# Altium project DC_Main_sample_A.PrjPcb (part 2 of 2)

## Sheet STM32.SchDoc
size D; SheetNumber: 8; SheetTotal: 8
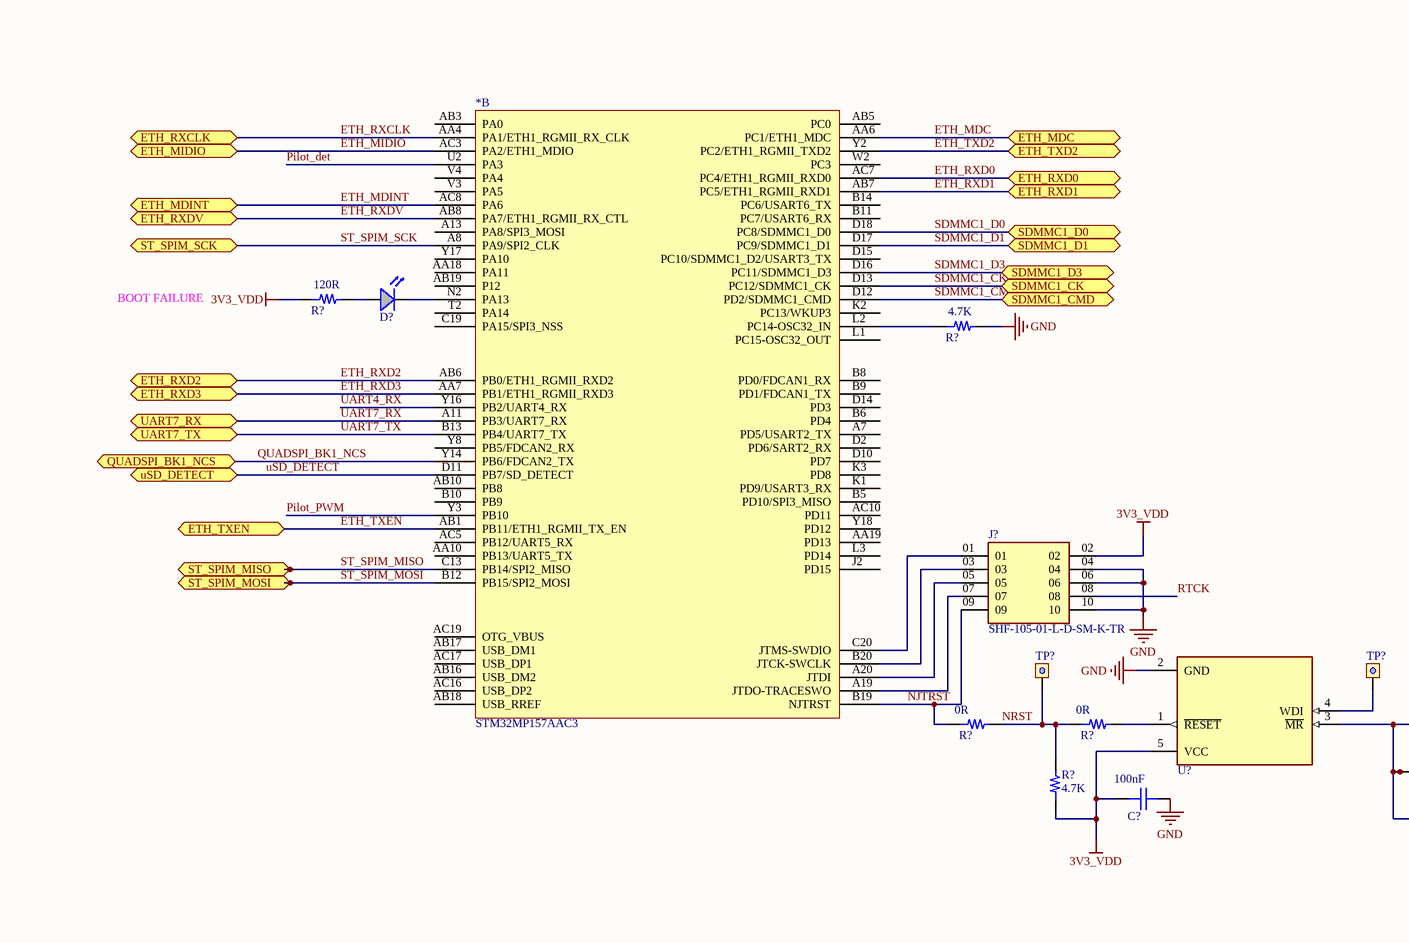
[diagram p6: STM32.SchDoc, top left]
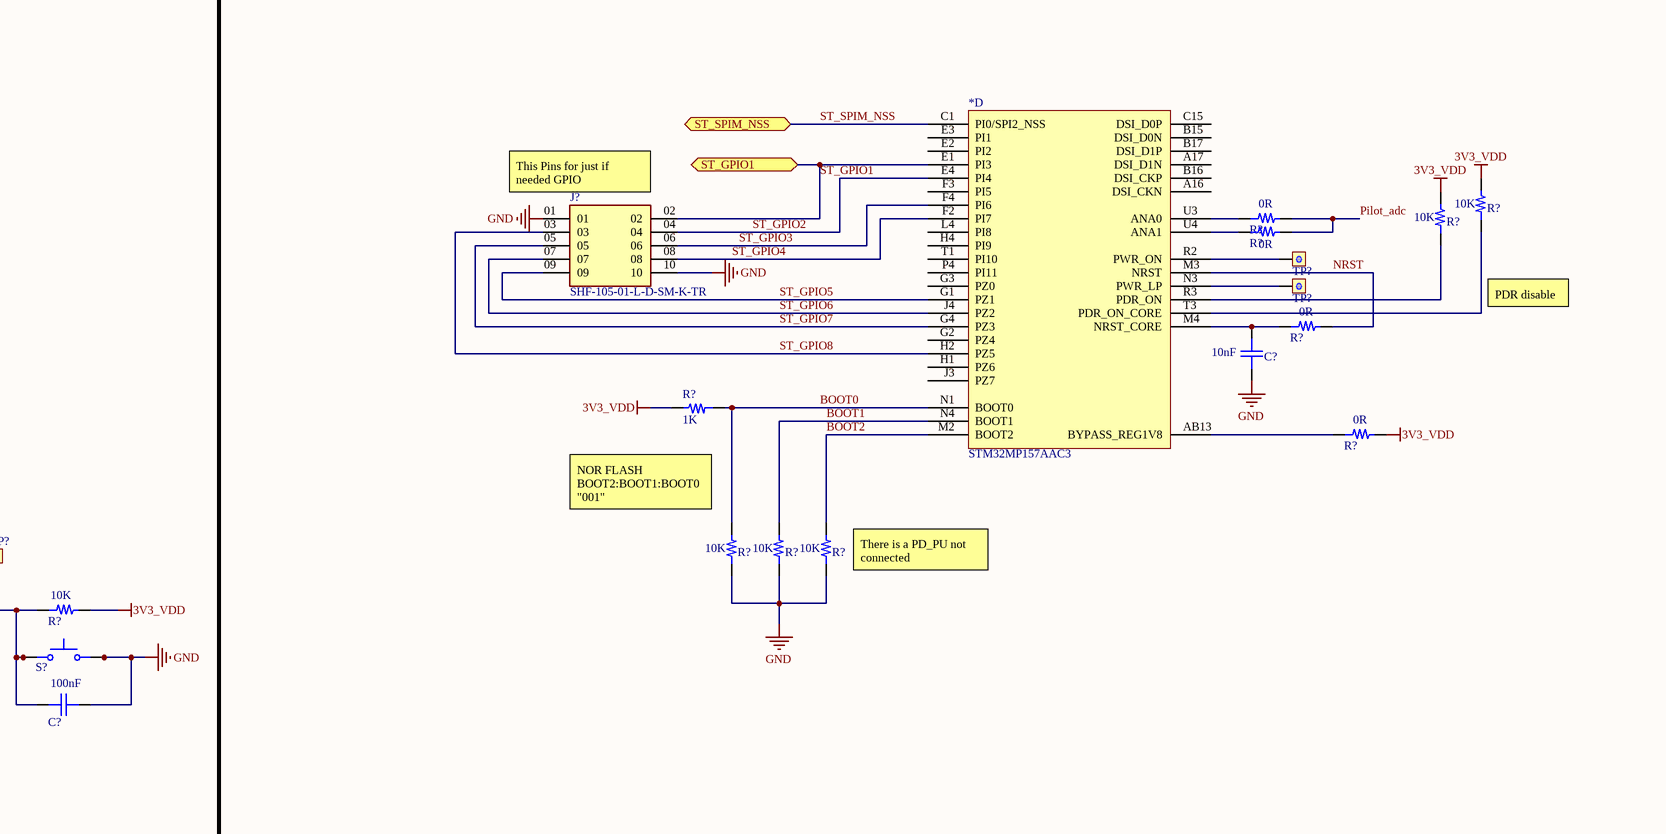
[diagram p7: STM32.SchDoc, top middle]
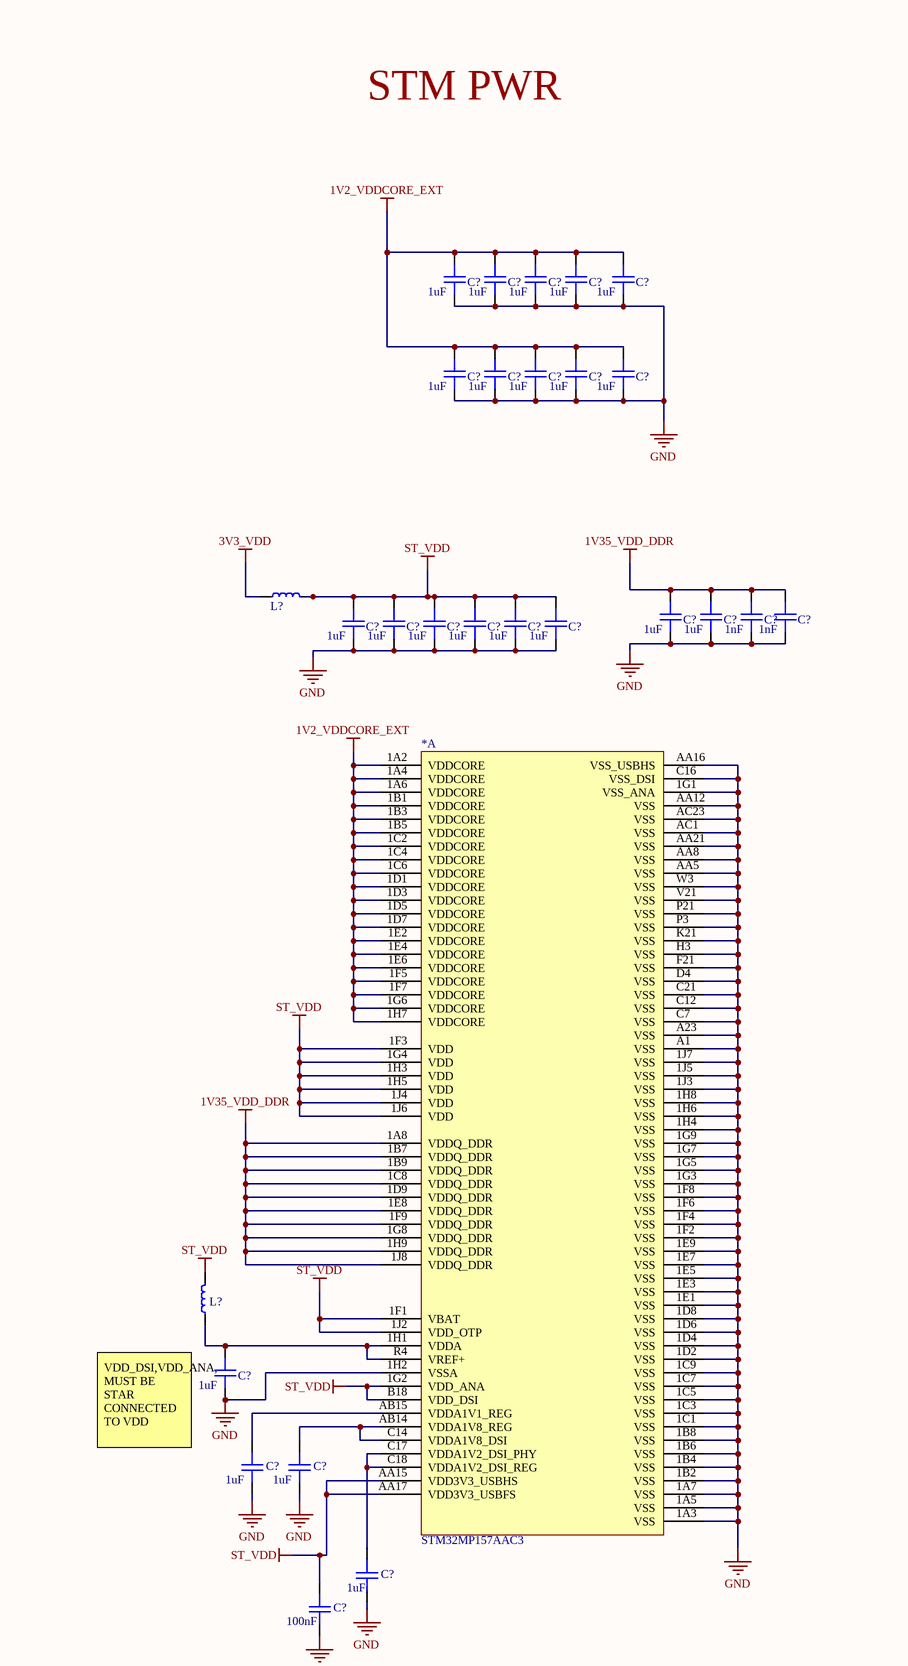
[diagram p8: STM32.SchDoc, top right]
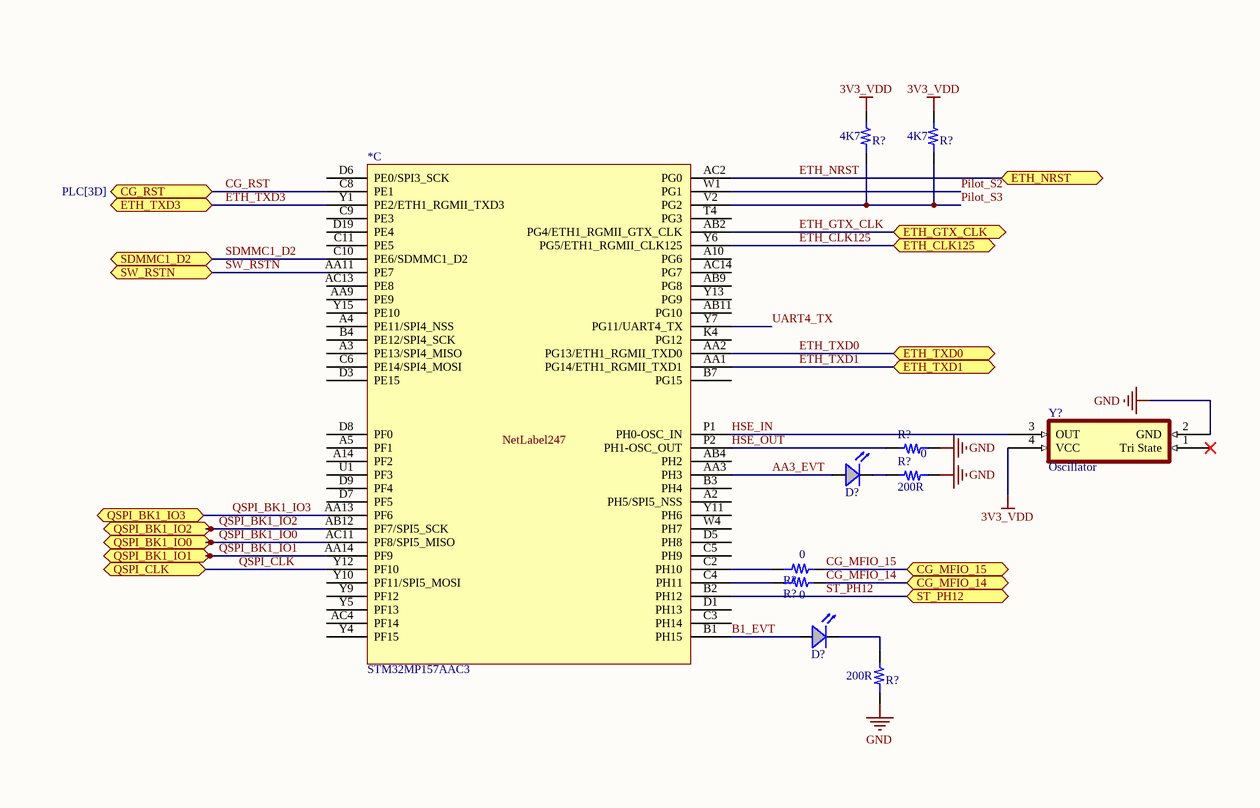
[diagram p9: STM32.SchDoc, bottom left]
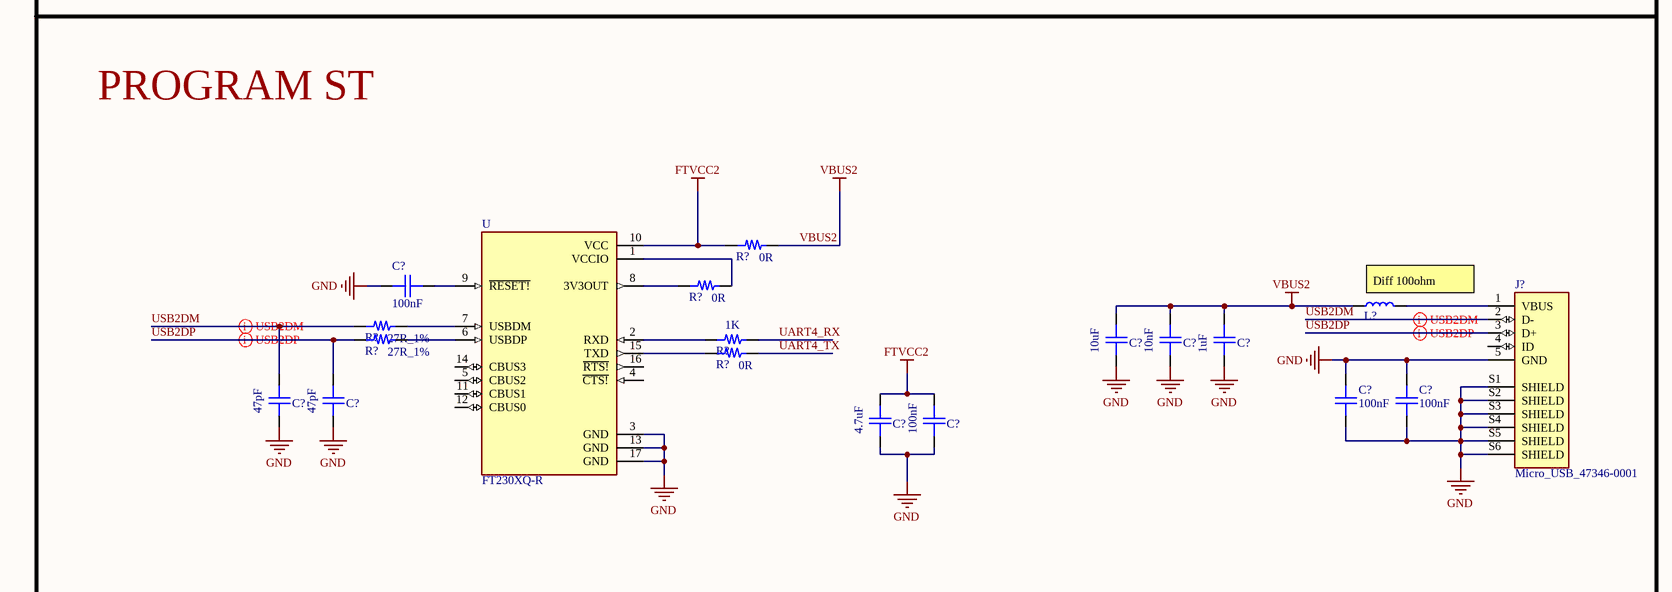
[diagram p10: STM32.SchDoc, bottom middle]
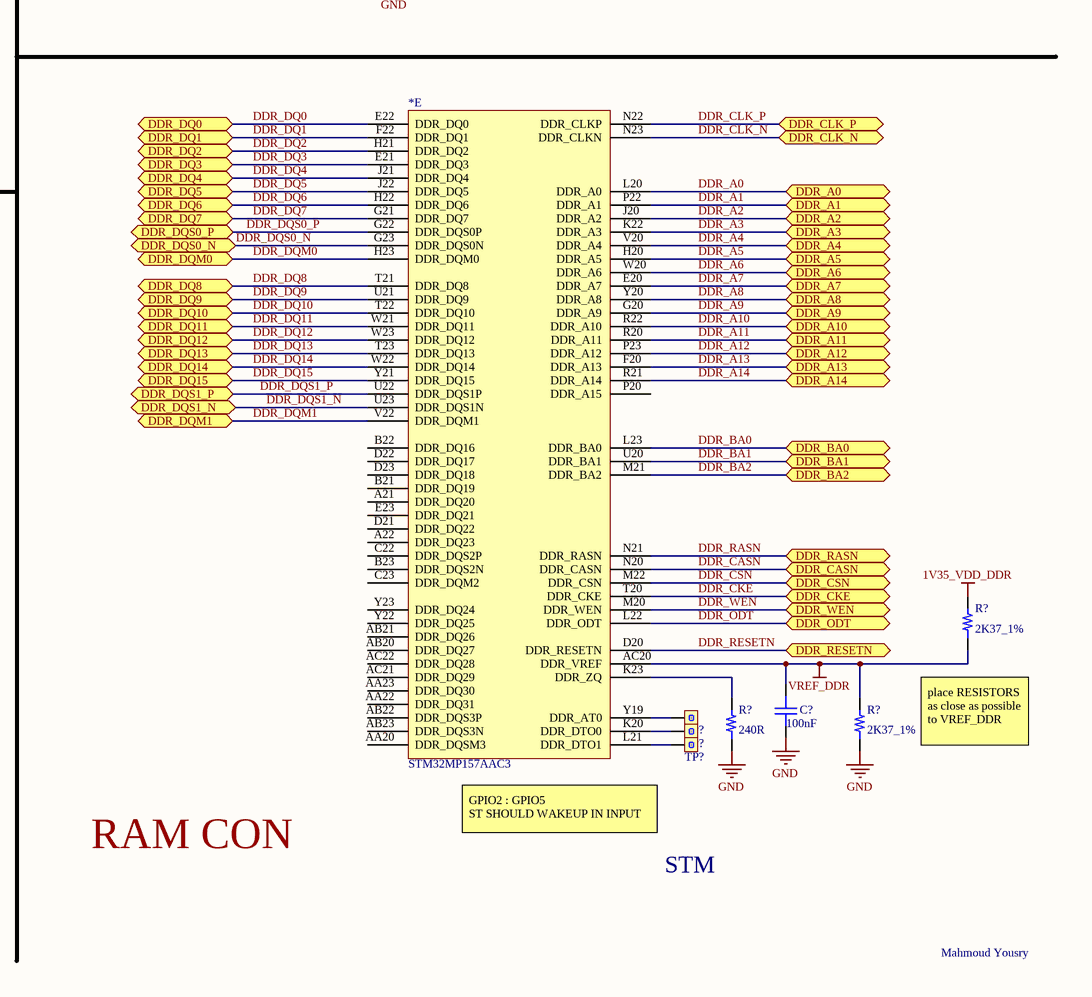
[diagram p11: STM32.SchDoc, bottom right]

### Parts
(Parts that share a designator on the sheet are numbered #1, #2 ... from top to bottom, then left to right.)
*#1  STM32MP157AAC3  (part B of 5)
*#2  STM32MP157AAC3  (part D of 5)
*#3  STM32MP157AAC3  (part A of 5)
*#4  STM32MP157AAC3  (part C of 5)
*#5  STM32MP157AAC3  (part E of 5)
C?#125  value 1uF  [C0402]  (hidden comment: Capacitor)
C?#126  value 1uF  [C0402]  (hidden comment: Capacitor)
C?#127  value 1uF  [C0402]  (hidden comment: Capacitor)
C?#128  value 1uF  [C0402]  (hidden comment: Capacitor)
C?#129  value 1uF  [C0402]  (hidden comment: Capacitor)
C?#130  value 1uF  [C0402]  (hidden comment: Capacitor)
C?#131  value 1uF  [C0402]  (hidden comment: Capacitor)
C?#132  value 1uF  [C0402]  (hidden comment: Capacitor)
C?#133  value 1uF  [C0402]  (hidden comment: Capacitor)
C?#134  value 1uF  [C0402]  (hidden comment: Capacitor)
C?#135  value 1uF  [C0402]  (hidden comment: Capacitor)
C?#136  value 1uF  [C0402]  (hidden comment: Capacitor)
C?#137  value 1nF  [C0402]  (hidden comment: Capacitor)
C?#138  value 1nF  [C0402]  (hidden comment: Capacitor)
C?#139  value 1uF  [C0402]  (hidden comment: Capacitor)
C?#140  value 1uF  [C0402]  (hidden comment: Capacitor)
C?#141  value 1uF  [C0402]  (hidden comment: Capacitor)
C?#142  value 1uF  [C0402]  (hidden comment: Capacitor)
C?#143  value 1uF  [C0402]  (hidden comment: Capacitor)
C?#144  value 1uF  [C0402]  (hidden comment: Capacitor)
C?#145  value 10nF  [C0402]  (hidden comment: Capacitor)
C?#146  value 100nF  [C0402]  (hidden comment: Capacitor)
C?#147  value 100nF  [C0402]  (hidden comment: Capacitor)
C?#148  value 1uF  [C0402]  (hidden comment: Capacitor)
C?#149  value 1uF  [C0402]  (hidden comment: Capacitor)
C?#150  value 1uF  [C0402]  (hidden comment: Capacitor)
C?#151  value 1uF  [C0402]  (hidden comment: Capacitor)
C?#152  value 100nF  [C0402]  (hidden comment: Capacitor)
C?#153  value 100nF  [C0402]  (hidden comment: Capacitor)
C?#154  value 10uF  [C0402]  (hidden comment: Capacitor)
C?#155  value 10nF  [C0402]  (hidden comment: Capacitor)
C?#156  value 1uF  [C0402]  (hidden comment: Capacitor)
C?#157  value 47pF  [C0402]  (hidden comment: Capacitor)
C?#158  value 47pF  [C0402]  (hidden comment: Capacitor)
C?#159  value 100nF  [C0402]  (hidden comment: Capacitor)
C?#160  value 100nF  [C0402]  (hidden comment: Capacitor)
C?#161  value 4.7uF  [C0402]  (hidden comment: Capacitor)
C?#162  value 100nF  [C0402]  (hidden comment: Capacitor)
C?#163  value 100nF  [C0402]  (hidden comment: Capacitor)
D?#7  LED  [LED_0603]  (value not drawn)
D?#8  LED  [LED_0603]  (value not drawn)
D?#9  LED  [LED_0603]  (value not drawn)
J?#5  SHF-105-01-L-D-SM-K-TR  [SAMTEC_SHF-105-01-L-D-SM-K-TR]
J?#6  SHF-105-01-L-D-SM-K-TR  [SAMTEC_SHF-105-01-L-D-SM-K-TR]
J?#7  Micro_USB_47346-0001  [Micro_USB_47346-0001]
L?#16  Inductor  [L_0603]  (value not drawn)
L?#17  Inductor  [L_0603]  (value not drawn)
L?#18  Inductor  [L_0603]  (value not drawn)
R?#84  value 120R  [R0402]  (hidden comment: Resistor)
R?#85  value 4.7K  [R0402]  (hidden comment: Resistor)
R?#86  value 0R  [R0402]  (hidden comment: Resistor)
R?#87  value 0R  [R0402]  (hidden comment: Resistor)
R?#88  value 10K  [R0402]  (hidden comment: Resistor)
R?#89  value 10K  [R0402]  (hidden comment: Resistor)
R?#90  value 0R  [R0402]  (hidden comment: Resistor)
R?#91  value 1K  [R0402]  (hidden comment: Resistor)
R?#92  value 0R  [R0402]  (hidden comment: Resistor)
R?#93  value 10K  [R0402]  (hidden comment: Resistor)
R?#94  value 10K  [R0402]  (hidden comment: Resistor)
R?#95  value 10K  [R0402]  (hidden comment: Resistor)
R?#96  value 0R  [R0402]  (hidden comment: Resistor)
R?#97  value 0R  [R0402]  (hidden comment: Resistor)
R?#98  value 10K  [R0402]  (hidden comment: Resistor)
R?#99  value 4.7K  [R0402]  (hidden comment: Resistor)
R?#100  value 4K7  [R0402]  (hidden comment: Resistor)
R?#101  value 4K7  [R0402]  (hidden comment: Resistor)
R?#102  value 0  [R0402]  (hidden comment: Resistor)
R?#103  value 200R  [R0402]  (hidden comment: Resistor)
R?#104  value 0  [R0402]  (hidden comment: Resistor)
R?#105  value 0R  [R0402]  (hidden comment: Resistor)
R?#106  value 0  [R0402]  (hidden comment: Resistor)
R?#107  value 0R  [R0402]  (hidden comment: Resistor)
R?#108  value 27R_1%  [R0402]  (hidden comment: Resistor)
R?#109  value 27R_1%  [R0402]  (hidden comment: Resistor)
R?#110  value 1K  [R0402]  (hidden comment: Resistor)
R?#111  value 0R  [R0402]  (hidden comment: Resistor)
R?#112  value 200R  [R0402]  (hidden comment: Resistor)
R?#113  value 2K37_1%  [R0402]  (hidden comment: Resistor)
R?#114  value 240R  [R0402]  (hidden comment: Resistor)
R?#115  value 2K37_1%  [R0402]  (hidden comment: Resistor)
S?#3  Push Button 4 pin  [Push_Button(6x6mm)]  (value not drawn)
TP?#3  Test Point  [Test Point]  (value not drawn)
TP?#4  Test Point  [Test Point]  (value not drawn)
TP?#5  Test Point  [Test Point]  (value not drawn)
TP?#6  Test Point  [Test Point]  (value not drawn)
TP?#7  Test Point  [Test Point]  (value not drawn)
TP?#8  Test Point  [Test Point]  (value not drawn)
TP?#9  Test Point  [Test Point]  (value not drawn)
U  FT230XQ-R  [FT230XQ-R]
U?#13  Supervisory Circuits  [SOT-23-5]  (value not drawn)
Y?#3  Oscillator  [ECS-3225Q-33-240-BS-TR]

### Ports
CG_MFIO_14 (bidir), CG_MFIO_15 (bidir), CG_RST (bidir, see PLC[3D]), DDR_A0 (bidir), DDR_A1 (bidir), DDR_A2 (bidir), DDR_A3 (bidir), DDR_A4 (bidir), DDR_A5 (bidir), DDR_A6 (bidir), DDR_A7 (bidir), DDR_A8 (bidir), DDR_A9 (bidir), DDR_A10 (bidir), DDR_A11 (bidir), DDR_A12 (bidir), DDR_A13 (bidir), DDR_A14 (bidir), DDR_BA0 (bidir), DDR_BA1 (bidir), DDR_BA2 (bidir), DDR_CASN (bidir), DDR_CKE (bidir), DDR_CLK_N (bidir), DDR_CLK_P (bidir), DDR_CSN (bidir), DDR_DQ0 (bidir), DDR_DQ1 (bidir), DDR_DQ2 (bidir), DDR_DQ3 (bidir), DDR_DQ4 (bidir), DDR_DQ5 (bidir), DDR_DQ6 (bidir), DDR_DQ7 (bidir), DDR_DQ8 (bidir), DDR_DQ9 (bidir), DDR_DQ10 (bidir), DDR_DQ11 (bidir), DDR_DQ12 (bidir), DDR_DQ13 (bidir), DDR_DQ14 (bidir), DDR_DQ15 (bidir), DDR_DQM0 (bidir), DDR_DQM1 (bidir), DDR_DQS0_N (bidir), DDR_DQS0_P (bidir), DDR_DQS1_N (bidir), DDR_DQS1_P (bidir), DDR_ODT (bidir), DDR_RASN (bidir), DDR_RESETN (bidir), DDR_WEN (bidir), ETH_CLK125 (bidir), ETH_GTX_CLK (bidir), ETH_MDC (bidir), ETH_MDINT (bidir), ETH_MIDIO (bidir), ETH_NRST (bidir), ETH_RXCLK (bidir), ETH_RXD0 (bidir), ETH_RXD1 (bidir), ETH_RXD2 (bidir), ETH_RXD3 (bidir), ETH_RXDV (bidir), ETH_TXD0 (bidir), ETH_TXD1 (bidir), ETH_TXD2 (bidir), ETH_TXD3 (bidir), ETH_TXEN (bidir), QSPI_BK1_IO0 (bidir), QSPI_BK1_IO1 (bidir), QSPI_BK1_IO2 (bidir), QSPI_BK1_IO3 (bidir), QSPI_CLK (bidir), QUADSPI_BK1_NCS (bidir), SDMMC1_CK (bidir), SDMMC1_CMD (bidir), SDMMC1_D0 (bidir), SDMMC1_D1 (bidir), SDMMC1_D2 (bidir), SDMMC1_D3 (bidir), ST_GPIO1 (bidir), ST_PH12 (bidir), ST_SPIM_MISO (bidir), ST_SPIM_MOSI (bidir), ST_SPIM_NSS (bidir), ST_SPIM_SCK (bidir), SW_RSTN (bidir), UART7_RX (bidir), UART7_TX (bidir), uSD_DETECT (bidir)

### Nets
1V2_VDDCORE_EXT: *#3.1A2(VDDCORE) *#3.1A4(VDDCORE) *#3.1A6(VDDCORE) *#3.1B1(VDDCORE) *#3.1B3(VDDCORE) *#3.1B5(VDDCORE) *#3.1C2(VDDCORE) *#3.1C4(VDDCORE) *#3.1C6(VDDCORE) *#3.1D1(VDDCORE) *#3.1D3(VDDCORE) *#3.1D5(VDDCORE) *#3.1D7(VDDCORE) *#3.1E2(VDDCORE) *#3.1E4(VDDCORE) *#3.1E6(VDDCORE) *#3.1F5(VDDCORE) *#3.1F7(VDDCORE) *#3.1G6(VDDCORE) *#3.1H7(VDDCORE) C?#125.1 C?#126.1 C?#127.1 C?#128.1 C?#129.1 C?#130.1 C?#131.1 C?#132.1 C?#133.1 C?#134.1
1V35_VDD_DDR: *#3.1A8(VDDQ_DDR) *#3.1B7(VDDQ_DDR) *#3.1B9(VDDQ_DDR) *#3.1C8(VDDQ_DDR) *#3.1D9(VDDQ_DDR) *#3.1E8(VDDQ_DDR) *#3.1F9(VDDQ_DDR) *#3.1G8(VDDQ_DDR) *#3.1H9(VDDQ_DDR) *#3.1J8(VDDQ_DDR) C?#135.1 C?#136.1 C?#137.1 C?#138.1 R?#113.1
3V3_VDD: C?#146.1 J?#6.02 L?#16.1 R?#84.1 R?#88.1 R?#89.1 R?#91.1 R?#92.1 R?#98.1 R?#99.1 R?#100.1 R?#101.1 U?#13.5(VCC) Y?#3.4(VCC)  [project net 3V3_CG]
FTVCC2: C?#161.1 C?#162.1 R?#105.1 U.10(VCC)
GND: *#3.1A3(VSS) *#3.1A5(VSS) *#3.1A7(VSS) *#3.1B2(VSS) *#3.1B4(VSS) *#3.1B6(VSS) *#3.1B8(VSS) *#3.1C1(VSS) *#3.1C3(VSS) *#3.1C5(VSS) *#3.1C7(VSS) *#3.1C9(VSS) *#3.1D2(VSS) *#3.1D4(VSS) *#3.1D6(VSS) *#3.1D8(VSS) *#3.1E1(VSS) *#3.1E3(VSS) *#3.1E5(VSS) *#3.1E7(VSS) *#3.1E9(VSS) *#3.1F2(VSS) *#3.1F4(VSS) *#3.1F6(VSS) *#3.1F8(VSS) *#3.1G1(VSS_ANA) *#3.1G3(VSS) *#3.1G5(VSS) *#3.1G7(VSS) *#3.1G9(VSS) *#3.1H2(VSSA) *#3.1H4(VSS) *#3.1H6(VSS) *#3.1H8(VSS) *#3.1J3(VSS) *#3.1J5(VSS) *#3.1J7(VSS) *#3.A1(VSS) *#3.A23(VSS) *#3.AA5(VSS) *#3.AA8(VSS) *#3.AA12(VSS) *#3.AA16(VSS_USBHS) *#3.AA21(VSS) *#3.AC1(VSS) *#3.AC23(VSS) *#3.C7(VSS) *#3.C12(VSS) *#3.C16(VSS_DSI) *#3.C21(VSS) *#3.D4(VSS) *#3.F21(VSS) *#3.H3(VSS) *#3.K21(VSS) *#3.P3(VSS) *#3.P21(VSS) *#3.V21(VSS) *#3.W3(VSS) C?#125.1 C?#126.1 C?#127.1 C?#128.1 C?#129.1 C?#130.1 C?#131.1 C?#132.1 C?#133.1 C?#134.1 C?#135.1 C?#136.1 C?#137.1 C?#138.1 C?#139.1 C?#140.1 C?#141.1 C?#142.1 C?#143.1 C?#144.1 C?#145.1 C?#146.1 C?#147.1 C?#148.1 C?#149.1 C?#150.1 C?#151.1 C?#152.1 C?#153.1 C?#154.1 C?#155.1 C?#156.1 C?#157.1 C?#158.1 C?#159.1 C?#160.1 C?#161.1 C?#162.1 C?#163.1 J?#5.01 J?#5.10 J?#6.04 J?#6.06 J?#6.10 J?#7.5(GND) J?#7.S1(SHIELD) J?#7.S2(SHIELD) J?#7.S3(SHIELD) J?#7.S4(SHIELD) J?#7.S5(SHIELD) J?#7.S6(SHIELD) R?#85.1 R?#93.1 R?#94.1 R?#95.1 R?#102.1 R?#103.1 R?#112.1 R?#114.1 R?#115.1 S?#3.3 S?#3.4 U.3(GND) U.13(GND) U.17(GND) U?#13.2(GND) Y?#3.2(GND)
ST_VDD: *#3.1F1(VBAT) *#3.1F3(VDD) *#3.1G2(VDD_ANA) *#3.1G4(VDD) *#3.1H3(VDD) *#3.1H5(VDD) *#3.1J2(VDD_OTP) *#3.1J4(VDD) *#3.1J6(VDD) *#3.AA15(VDD3V3_USBHS) *#3.AA17(VDD3V3_USBFS) *#3.B18(VDD_DSI) C?#139.1 C?#140.1 C?#141.1 C?#142.1 C?#143.1 C?#144.1 C?#152.1 L?#16.2 L?#17.2
VBUS2: C?#154.1 C?#155.1 C?#156.1 L?#18.1 R?#105.1
VREF_DDR: *#5.AC20(DDR_VREF) C?#163.1 R?#113.1 R?#115.1
AA3_EVT: *#4.AA3(PH3) D?#8.A
B1_EVT: *#4.B1(PH15) D?#9.A
BOOT0: *#2.N1(BOOT0) R?#91.1 R?#93.1
BOOT1: *#2.N4(BOOT1) R?#94.1
BOOT2: *#2.M2(BOOT2) R?#95.1
CG_MFIO_14: R?#106.1 ; port CG_MFIO_14
CG_MFIO_15: R?#104.1 ; port CG_MFIO_15
CG_RST: *#4.C8(PE1) ; port CG_RST
DDR_A0: *#5.L20(DDR_A0) ; port DDR_A0
DDR_A1: *#5.P22(DDR_A1) ; port DDR_A1
DDR_A2: *#5.J20(DDR_A2) ; port DDR_A2
DDR_A3: *#5.K22(DDR_A3) ; port DDR_A3
DDR_A4: *#5.V20(DDR_A4) ; port DDR_A4
DDR_A5: *#5.H20(DDR_A5) ; port DDR_A5
DDR_A6: *#5.W20(DDR_A6) ; port DDR_A6
DDR_A7: *#5.E20(DDR_A7) ; port DDR_A7
DDR_A8: *#5.Y20(DDR_A8) ; port DDR_A8
DDR_A9: *#5.G20(DDR_A9) ; port DDR_A9
DDR_A10: *#5.R22(DDR_A10) ; port DDR_A10
DDR_A11: *#5.R20(DDR_A11) ; port DDR_A11
DDR_A12: *#5.P23(DDR_A12) ; port DDR_A12
DDR_A13: *#5.F20(DDR_A13) ; port DDR_A13
DDR_A14: *#5.R21(DDR_A14) ; port DDR_A14
DDR_BA0: *#5.L23(DDR_BA0) ; port DDR_BA0
DDR_BA1: *#5.U20(DDR_BA1) ; port DDR_BA1
DDR_BA2: *#5.M21(DDR_BA2) ; port DDR_BA2
DDR_CASN: *#5.N20(DDR_CASN) ; port DDR_CASN
DDR_CKE: *#5.T20(DDR_CKE) ; port DDR_CKE
DDR_CLK_N: *#5.N23(DDR_CLKN) ; port DDR_CLK_N
DDR_CLK_P: *#5.N22(DDR_CLKP) ; port DDR_CLK_P
DDR_CSN: *#5.M22(DDR_CSN) ; port DDR_CSN
DDR_DQ0: *#5.E22(DDR_DQ0) ; port DDR_DQ0
DDR_DQ1: *#5.F22(DDR_DQ1) ; port DDR_DQ1
DDR_DQ2: *#5.H21(DDR_DQ2) ; port DDR_DQ2
DDR_DQ3: *#5.E21(DDR_DQ3) ; port DDR_DQ3
DDR_DQ4: *#5.J21(DDR_DQ4) ; port DDR_DQ4
DDR_DQ5: *#5.J22(DDR_DQ5) ; port DDR_DQ5
DDR_DQ6: *#5.H22(DDR_DQ6) ; port DDR_DQ6
DDR_DQ7: *#5.G21(DDR_DQ7) ; port DDR_DQ7
DDR_DQ8: *#5.T21(DDR_DQ8) ; port DDR_DQ8
DDR_DQ9: *#5.U21(DDR_DQ9) ; port DDR_DQ9
DDR_DQ10: *#5.T22(DDR_DQ10) ; port DDR_DQ10
DDR_DQ11: *#5.W21(DDR_DQ11) ; port DDR_DQ11
DDR_DQ12: *#5.W23(DDR_DQ12) ; port DDR_DQ12
DDR_DQ13: *#5.T23(DDR_DQ13) ; port DDR_DQ13
DDR_DQ14: *#5.W22(DDR_DQ14) ; port DDR_DQ14
DDR_DQ15: *#5.Y21(DDR_DQ15) ; port DDR_DQ15
DDR_DQM0: *#5.H23(DDR_DQM0) ; port DDR_DQM0
DDR_DQM1: *#5.V22(DDR_DQM1) ; port DDR_DQM1
DDR_DQS0_N: *#5.G23(DDR_DQS0N) ; port DDR_DQS0_N
DDR_DQS0_P: *#5.G22(DDR_DQS0P) ; port DDR_DQS0_P
DDR_DQS1_N: *#5.U23(DDR_DQS1N) ; port DDR_DQS1_N
DDR_DQS1_P: *#5.U22(DDR_DQS1P) ; port DDR_DQS1_P
DDR_ODT: *#5.L22(DDR_ODT) ; port DDR_ODT
DDR_RASN: *#5.N21(DDR_RASN) ; port DDR_RASN
DDR_RESETN: *#5.D20(DDR_RESETN) ; port DDR_RESETN
DDR_WEN: *#5.M20(DDR_WEN) ; port DDR_WEN
ETH_CLK125: *#4.Y6(PG5/ETH1_RGMII_CLK125) ; port ETH_CLK125
ETH_GTX_CLK: *#4.AB2(PG4/ETH1_RGMII_GTX_CLK) ; port ETH_GTX_CLK
ETH_MDC: *#1.AA6(PC1/ETH1_MDC) ; port ETH_MDC
ETH_MDINT: *#1.AC8(PA6) ; port ETH_MDINT
ETH_MIDIO: *#1.AC3(PA2/ETH1_MDIO) ; port ETH_MIDIO
ETH_NRST: *#4.AC2(PG0) ; port ETH_NRST
ETH_RXCLK: *#1.AA4(PA1/ETH1_RGMII_RX_CLK) ; port ETH_RXCLK
ETH_RXD0: *#1.AC7(PC4/ETH1_RGMII_RXD0) ; port ETH_RXD0
ETH_RXD1: *#1.AB7(PC5/ETH1_RGMII_RXD1) ; port ETH_RXD1
ETH_RXD2: *#1.AB6(PB0/ETH1_RGMII_RXD2) ; port ETH_RXD2
ETH_RXD3: *#1.AA7(PB1/ETH1_RGMII_RXD3) ; port ETH_RXD3
ETH_RXDV: *#1.AB8(PA7/ETH1_RGMII_RX_CTL) ; port ETH_RXDV
ETH_TXD0: *#4.AA2(PG13/ETH1_RGMII_TXD0) ; port ETH_TXD0
ETH_TXD1: *#4.AA1(PG14/ETH1_RGMII_TXD1) ; port ETH_TXD1
ETH_TXD2: *#1.Y2(PC2/ETH1_RGMII_TXD2) ; port ETH_TXD2
ETH_TXD3: *#4.Y1(PE2/ETH1_RGMII_TXD3) ; port ETH_TXD3
ETH_TXEN: *#1.AB1(PB11/ETH1_RGMII_TX_EN) ; port ETH_TXEN
HSE_IN: *#4.P1(PH0-OSC_IN) Y?#3.3(OUT)
HSE_OUT: *#4.P2(PH1-OSC_OUT) R?#102.1
NJTRST: *#1.B19(NJTRST) J?#6.09 R?#96.1
NRST: *#2.M3(NRST) R?#90.1 R?#96.1 R?#97.1 R?#99.1 TP?#5.0
Pilot_adc: R?#86.1 R?#87.1
Pilot_det: *#1.U2(PA3)
Pilot_PWM: *#1.Y3(PB10)
Pilot_S2: *#4.W1(PG1)
Pilot_S3: *#4.V2(PG2) R?#100.1 R?#101.1
QSPI_BK1_IO0: *#4.AC11(PF8/SPI5_MISO) ; port QSPI_BK1_IO0
QSPI_BK1_IO1: *#4.AA14(PF9) ; port QSPI_BK1_IO1
QSPI_BK1_IO2: *#4.AB12(PF7/SPI5_SCK) ; port QSPI_BK1_IO2
QSPI_BK1_IO3: *#4.AA13(PF6) ; port QSPI_BK1_IO3
QSPI_CLK: *#4.Y12(PF10) ; port QSPI_CLK
QUADSPI_BK1_NCS: *#1.Y14(PB6/FDCAN2_TX) ; port QUADSPI_BK1_NCS
RTCK: J?#6.08
SDMMC1_CK: *#1.D13(PC12/SDMMC1_CK) ; port SDMMC1_CK
SDMMC1_CMD: *#1.D12(PD2/SDMMC1_CMD) ; port SDMMC1_CMD
SDMMC1_D0: *#1.D18(PC8/SDMMC1_D0) ; port SDMMC1_D0
SDMMC1_D1: *#1.D17(PC9/SDMMC1_D1) ; port SDMMC1_D1
SDMMC1_D2: *#4.C10(PE6/SDMMC1_D2) ; port SDMMC1_D2
SDMMC1_D3: *#1.D16(PC11/SDMMC1_D3) ; port SDMMC1_D3
ST_GPIO1: *#2.E1(PI3) J?#5.02 ; port ST_GPIO1
ST_GPIO2: *#2.E4(PI4) J?#5.04
ST_GPIO3: *#2.F4(PI6) J?#5.06
ST_GPIO4: *#2.F2(PI7) J?#5.08
ST_GPIO5: *#2.G1(PZ1) J?#5.09
ST_GPIO6: *#2.J4(PZ2) J?#5.07
ST_GPIO7: *#2.G4(PZ3) J?#5.05
ST_GPIO8: *#2.H2(PZ5) J?#5.03
ST_PH12: *#4.B2(PH12) ; port ST_PH12
ST_SPIM_MISO: *#1.C13(PB14/SPI2_MISO) ; port ST_SPIM_MISO
ST_SPIM_MOSI: *#1.B12(PB15/SPI2_MOSI) ; port ST_SPIM_MOSI
ST_SPIM_NSS: *#2.C1(PI0/SPI2_NSS) ; port ST_SPIM_NSS
ST_SPIM_SCK: *#1.A8(PA9/SPI2_CLK) ; port ST_SPIM_SCK
SW_RSTN: *#4.AA11(PE7) ; port SW_RSTN
UART4_RX: *#1.Y16(PB2/UART4_RX) R?#110.1
UART4_TX: *#4.Y7(PG11/UART4_TX) R?#111.1
UART7_RX: *#1.A11(PB3/UART7_RX) ; port UART7_RX
UART7_TX: *#1.B13(PB4/UART7_TX) ; port UART7_TX
USB2DM: C?#157.1 J?#7.2(D-) R?#108.1
USB2DP: C?#158.1 J?#7.3(D+) R?#109.1
uSD_DETECT: *#1.D11(PB7/SD_DETECT) ; port uSD_DETECT
Net*#1_A19: *#1.A19(JTDO-TRACESWO) J?#6.07
Net*#1_A20: *#1.A20(JTDI) J?#6.05
Net*#1_B20: *#1.B20(JTCK-SWCLK) J?#6.03
Net*#1_C20: *#1.C20(JTMS-SWDIO) J?#6.01
Net*#1_L2: *#1.L2(PC14-OSC32_IN) R?#85.1
Net*#1_N2: *#1.N2(PA13) D?#7.C(K)
Net*#2_AB13: *#2.AB13(BYPASS_REG1V8) R?#92.1
Net*#2_M4: *#2.M4(NRST_CORE) C?#145.1 R?#90.1
Net*#2_N3: *#2.N3(PWR_LP) TP?#4.0
Net*#2_R2: *#2.R2(PWR_ON) TP?#3.0
Net*#2_R3: *#2.R3(PDR_ON) R?#89.1
Net*#2_T3: *#2.T3(PDR_ON_CORE) R?#88.1
Net*#2_U3: *#2.U3(ANA0) R?#86.1
Net*#2_U4: *#2.U4(ANA1) R?#87.1
Net*#3_1H1: *#3.1H1(VDDA) *#3.R4(VREF+) C?#148.1 L?#17.1
Net*#3_AB14: *#3.AB14(VDDA1V8_REG) *#3.C14(VDDA1V8_DSI) C?#150.1
Net*#3_AB15: *#3.AB15(VDDA1V1_REG) C?#149.1
Net*#3_C17: *#3.C17(VDDA1V2_DSI_PHY) *#3.C18(VDDA1V2_DSI_REG) C?#151.1
Net*#4_C2: *#4.C2(PH10) R?#104.1
Net*#4_C4: *#4.C4(PH11) R?#106.1
Net*#5_K20: *#5.K20(DDR_DTO0) TP?#8.0
Net*#5_K23: *#5.K23(DDR_ZQ) R?#114.1
Net*#5_L21: *#5.L21(DDR_DTO1) TP?#9.0
Net*#5_Y19: *#5.Y19(DDR_AT0) TP?#7.0
NetC?#147_1: C?#147.1 R?#98.1 S?#3.1 S?#3.2 U?#13.3(~{MR})
NetC?#153_1: C?#153.1 U.9(~{RESET!})
NetD?#7_A: D?#7.A R?#84.1
NetD?#8_C: D?#8.C(K) R?#103.1
NetD?#9_C: D?#9.C(K) R?#112.1
NetJ?#7_1: J?#7.1(VBUS) L?#18.2
NetR?#97_1: R?#97.1 U?#13.1(~{RESET})
NetR?#107_1: R?#107.1 U.1(VCCIO)
NetR?#107_1: R?#107.1 U.8(3V3OUT)  [a separate net that carries the same name]
NetR?#108_1: R?#108.1 U.7(USBDM)
NetR?#109_1: R?#109.1 U.6(USBDP)
NetR?#110_1: R?#110.1 U.2(RXD)
NetR?#111_1: R?#111.1 U.15(TXD)
NetTP?#6_0: TP?#6.0 U?#13.4(WDI)

Not connected (* = marked no-connect by the designer): *#1 A7(PD5/USART2_TX) A13(PA8/SPI3_MOSI) AA10(PB13/UART5_TX) AA18(PA11) AA19(PD13) AB3(PA0) AB5(PC0) AB10(PB8) AB16(USB_DM2) AB17(USB_DM1) AB18(USB_RREF) AB19(P12) AC5(PB12/UART5_RX) AC10(PD11) AC16(USB_DP2) AC17(USB_DP1) AC19(OTG_VBUS) B5(PD10/SPI3_MISO) B6(PD4) B8(PD0/FDCAN1_RX) B9(PD1/FDCAN1_TX) B10(PB9) B11(PC7/USART6_RX) B14(PC6/USART6_TX) C19(PA15/SPI3_NSS) D2(PD6/SART2_RX) D10(PD7) D14(PD3) D15(PC10/SDMMC1_D2/USART3_TX) J2(PD15) K1(PD9/USART3_RX) K2(PC13/WKUP3) K3(PD8) L1(PC15-OSC32_OUT) L3(PD14) T2(PA14) V3(PA5) V4(PA4) W2(PC3) Y8(PB5/FDCAN2_RX) Y17(PA10) Y18(PD12); *#2 A16(DSI_CKN) A17(DSI_D1N) B15(DSI_D0N) B16(DSI_CKP) B17(DSI_D1P) C15(DSI_D0P) E2(PI2) E3(PI1) F3(PI5) G2(PZ4) G3(PZ0) H1(PZ6) H4(PI9) J3(PZ7) L4(PI8) P4(PI11) T1(PI10); *#4 A2(PH5/SPI5_NSS) A3(PE13/SPI4_MISO) A4(PE11/SPI4_NSS) A5(PF1) A10(PG6) A14(PF2) AA9(PE9) AB4(PH2) AB9(PG8) AB11(PG10) AC4(PF14) AC13(PE8) AC14(PG7) B3(PH4) B4(PE12/SPI4_SCK) B7(PG15) C3(PH14) C5(PH9) C6(PE14/SPI4_MOSI) C9(PE3) C11(PE5) D1(PH13) D3(PE15) D5(PH8) D6(PE0/SPI3_SCK) D7(PF5) D8(PF0) D9(PF4) D19(PE4) K4(PG12) T4(PG3) U1(PF3) W4(PH7) Y4(PF15) Y5(PF13) Y9(PF12) Y10(PF11/SPI5_MOSI) Y11(PH6) Y13(PG9) Y15(PE10); *#5 A21(DDR_DQ20) A22(DDR_DQ23) AA20(DDR_DQSM3) AA22(DDR_DQ31) AA23(DDR_DQ30) AB20(DDR_DQ27) AB21(DDR_DQ26) AB22(DDR_DQS3P) AB23(DDR_DQS3N) AC21(DDR_DQ29) AC22(DDR_DQ28) B21(DDR_DQ19) B22(DDR_DQ16) B23(DDR_DQS2N) C22(DDR_DQS2P) C23(DDR_DQM2) D21(DDR_DQ22) D22(DDR_DQ17) D23(DDR_DQ18) E23(DDR_DQ21) P20(DDR_A15) Y22(DDR_DQ25) Y23(DDR_DQ24); J?#7 4(ID); U 4(~{CTS!}) 5(CBUS2) 11(CBUS1) 12(CBUS0) 14(CBUS3) 16(~{RTS!}); Y?#3 1(Tri_State)*

### Layout directives
differential pair; net class STM_USB: USB2DM, USB2DP

### Notes on the sheet
- STM PWR
- BOOT FAILURE
- (near J?#5) This Pins for just if needed GPIO
- PDR disable
- (near R?#93) NOR FLASH
  BOOT2:BOOT1:BOOT0
  "001"
- (near R?#95) There is a PD_PU not connected
- VDD_DSI,VDD_ANA, MUST BE STAR CONNECTED TO VDD
- PROGRAM ST
- (near L?#18) Diff 100ohm
- (near R?#113) place RESISTORS as close as possible to VREF_DDR
- RAM CON
- GPIO2 : GPIO5
  ST SHOULD WAKEUP IN INPUT
- STM
- Mahmoud Yousry
- Labels drawn without touching a wire or pin: NetLabel247

### Library data of the parts
C?#125-C?#163 = CAP_SMT: ComponentLink1Description: New link
J?#5 J?#6 = SHF-105-01-L-D-SM-K-TR: SMD Wire To Board Connector ROHS; MF: Samtec; Price: None; Package: None; MP: SHF-105-01-L-D-SM-K-TR; Availability: Unavailable; Value: *
J?#7 = Micro_USB_47346-0001: Conn Data USB Micro B w/Flange SMT Bottom Mnt LF | Molex Incorporated 47346-0001; SnapEDA_Link: https://www.snapeda.com/parts/47346-0001/Molex/view-part/?ref=snap; Package: None; Value: *; MF: Molex; MP: 47346-0001; Check_prices: https://www.snapeda.com/parts/47346-0001/Molex/view-part/?ref=eda
L?#16 L?#17 = Inductor_SMT: 120R_3A_0603; ComponentLink1Description: New link
L?#18 = Inductor_SMT: 600R_2A_1206; ComponentLink1Description: New link
R?#84 = RES_SMT: 180r_1%_0402; ComponentLink1Description: New link; ComponentLink1URL: *
R?#85 = RES_SMT: 4.7k; ComponentLink1Description: New link; ComponentLink1URL: *
R?#86-R?#115 = RES_SMT: ComponentLink1Description: New link; ComponentLink1URL: *
S?#3 = Push_Button: Push Button SMD(6x6mm) 4 pin; ComponentLink1Description: New link
U = FT230XQ-R: USB Bridge, USB to UART USB 2.0 UART Interface 16-QFN (4x4); MF: FTDI,; Availability: Unavailable; Value: *; DigiKey-Purchase-URL: https://snapeda.com/shop?store=DigiKey&id=51347; Package: QFN-16 FTDI; Price: None; MP: FT230XQ-R; SnapEDA_Link: https://www.snapeda.com/parts/FT230XQ-R/FTDI,%20Future%20Technology%20Devices%20International%20Ltd/view-part/51347/?ref=snap
U?#13 = MAX823: Supervisory Circuits 5-Pin Microprocessor Supervisory Circuit; ComponentLink1Description: New link; value: *
Y?#3 = ECS ECS-3225Q-33-240-BS-TR: SMD3225-4P Crystal Oscillators ROHS / 24MHz
*#1-*#5 = STM32MP157AAC3: manufacturer: *; manufacturer_part_no: *; supplier: *; supplier_part_no: *; pkg: *; value: *; ComponentLink1Description: New link; ComponentLink1URL: *
D?#7-D?#9 = LED: ComponentLink1Description: New link; ComponentLink1URL: *; value: *

## Nets that join several sheets
3.3VA: PLC (C?#38.1 U?#2.48 U?#2.51 U?#2.58), Analog_Interface (6 pins), Power_Supply (C?#99.1 C?#100.1 FB?.2)
3V3_CG: Control_Pilot (R?#1.1 R?#4.1 R?#6.1), PLC (31 pins), Power_Supply (6 pins), Screen_Interface (17 pins), CAN_Interface (C?#122.1 U?#12.1), STM32 (14 pins)
5V: Power_Supply (C?#91.1 L?#11.1), Screen_Interface (C?#103.1 C?#117.1 U?#9.5 U?#10.10)
5V_C: Power_Supply (5V_C.0 C?#93.1 U?#6.6), CAN_Interface (C?#123.1 U?#12.8)
C: Power_Supply (C?#93.1 U?#6.4), CAN_Interface (C?#123.1 C?#124.1 U?#12.5)
GND: Control_Pilot (8 pins), PLC (65 pins), Analog_Interface (14 pins), Power_Supply (18 pins), Screen_Interface (54 pins), CAN_Interface (C?#122.1 U?#12.4), STM32 (125 pins)
CG_RST: PLC (6 pins), STM32 (*#4.C8)
Net?#1_1: PLC (R?#12.1), Analog_Interface (?#1.1 C?#84.1 L?#7.2 R?#50.1)
Net?#2_2: PLC (R?#9.1), Analog_Interface (?#2.2 C?#84.1 L?#8.2 R?#60.1)
NetC?#66_1: PLC (R?#14.1), Analog_Interface (C?#66.1 C?#70.1 L?#5.2 T?#1.4)
NetC?#70_1: PLC (R?#10.1), Analog_Interface (C?#70.1 C?#71.1 L?#6.2 T?#1.2)
NetR?#16_1: PLC (R?#16.1), Analog_Interface (R?#69.1)
NetR?#17_1: PLC (R?#17.1), Analog_Interface (R?#45.1)
NetR?#18_1: PLC (R?#18.1), Analog_Interface (R?#65.1)
NetR?#20_1: PLC (R?#20.1), Analog_Interface (R?#42.1)